# EasyEDA Pro project 仿生青蛙驱动控制板-STM32F1-4.0.eprj

# Schematic Schematic1
Create Date: 2024-03-05; Page Name: P1; Project Name: 仿生青蛙驱动控制板-STM32F1-2.0 - 副本; Schematic Name: Schematic1; Update Date: 2024-03-24; Company: 嘉立创EDA; Page Size: A4; Version: V1.0
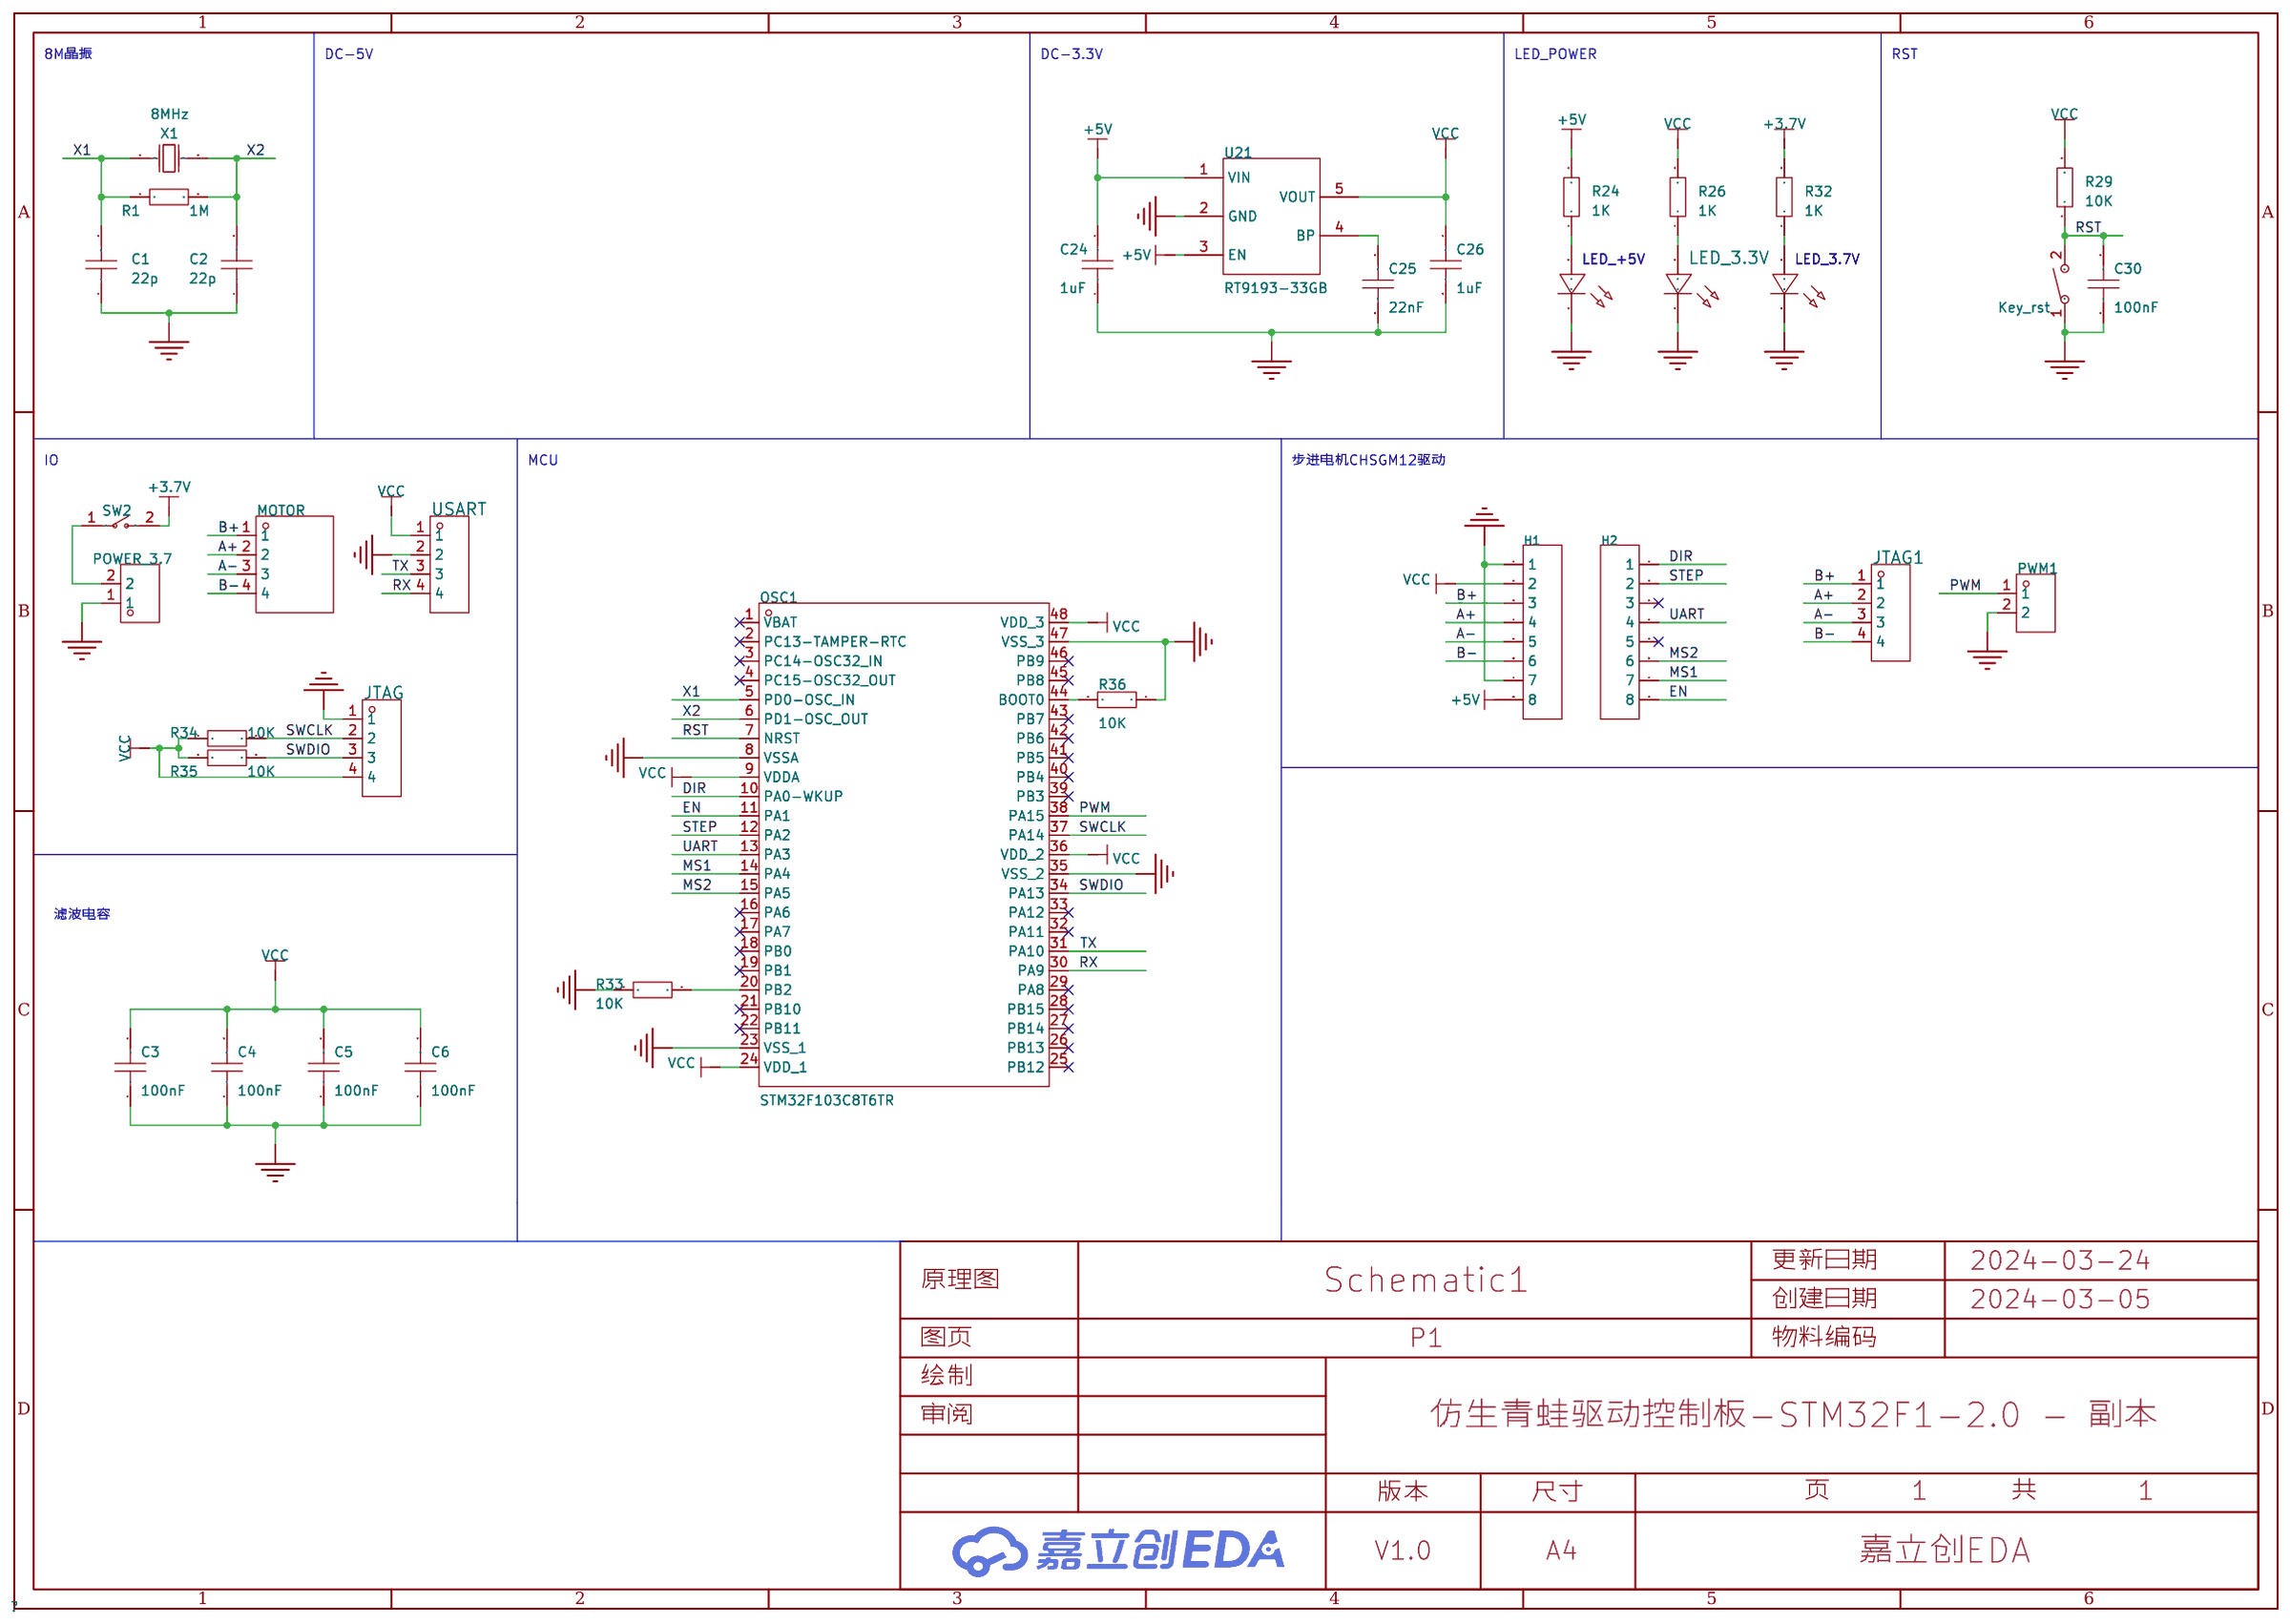
[diagram p0: schematic sheet]

## Parts
C1  22p  [c0603]
C2  22p  [c0603]
C3  100nF  [c0603]
C4  100nF  [c0603]
C5  100nF  [c0603]
C6  100nF  [c0603]
C24  1uF  [c0603]
C25  22nF  [c0603]
C26  1uF  [c0603]
C30  100nF  [c0603]
H1  -  [HDR-TH_8P-P2.54-V-F-1]
H2  -  [HDR-TH_8P-P2.54-V-F-1]
JTAG  -  [HDR-TH_4P-P2.54-V-F]
JTAG1  -  [HDR-TH_4P-P2.54-V-F]
Key_rst  TS-1092S-B3D2-G  [SW-SMD_L6.1-W3.6-LS7.9]
LED_3.3V  -  [LED_0603]
LED_3.7V  -  [LED_0603]
LED_+5V  -  [LED_0603]
MOTOR  DF13-4P-1.25DSA  [CONN-TH_DF13-4P-1.25DSA]
OSC1  STM32F103C8T6TR  [LQFP-48_L7.0-W7.0-P0.50-LS9.0-BL]
POWER_3.7  ZX-XH2.54-2PZZ  [CONN-TH_2P-P2.50_HX25003-2A]
PWM1  ZX-XH2.54-2PZZ  [CONN-TH_2P-P2.50_HX25003-2A]
R1  1M  [r0603]
R24  1K  [r0603]
R26  1K  [r0603]
R29  10K  [r0603]
R32  1K  [r0603]
R33  10K  [r0603]
R34  10K  [r0603]
R35  10K  [r0603]
R36  10K  [r0603]
SW2  KCD11-2P-R  [SW-TH_2P-L15.0-W10.5-P5.00_KCD11-2P-R]
U21  RT9193-33GB  [SOT-23-5_L3.0-W1.7-P0.95-LS2.8-BL]
USART  -  [HDR-TH_4P-P2.54-V-F]
X1  8MHz  [CRYSTAL-SMD_L5.0-W3.2]

## Library data of the parts
C1-C6 C24-C26 C30 = CAP_0402: Supplier Footprint: 0402
H1 H2 = HDR-F_2.54_1x8P: Supplier Part: C27438; Supplier Footprint: 插件
JTAG JTAG1 USART = HDR-F_2.54_1x4P: Supplier Part: C2718488; Supplier Footprint: 插件
Key_rst = TS-1092S-B3D2-G: 电路结构:单刀单掷;按钮形状:矩形按钮;作用力:250gf;安装方式:立贴;开关长度:6.1mm;开关宽度:3.6mm;开关高度:2.5mm;带支架:不带;机械寿命:-;; LCSC Part Name: 6.1*3.6*2.5mm 立贴 轻触开关; Supplier Part: C520860; Manufacturer: Yuandi(元迪); Supplier Footprint: SMD; JLCPCB Part Class: 扩展库; Datasheet: https://atta.szlcsc.com/upload/public/pdf/source/20200424/C520860_DA5AE47D9A9DC527FC720B5FF0895739.pdf; Supplier: LCSC; Circuit: 单刀单掷; Actuator Style: 矩形按钮; Operating Force: 250gf; Mounting Style: 立贴; Switch Length: 6.1mm; Switch Width: 3.6mm; Switch Height: 2.5mm; Strike Gundam: 不带; Actuator/Cap Color: 灰色; Pin Style: 鸥翼型
LED_3.3V = LED_0402-R: Supplier Footprint: 0402
LED_3.7V = LED_0402-B: Supplier Footprint: 0402
LED_+5V = LED_0603-G: Supplier Footprint: 0603
MOTOR = DF13-4P-1.25DSA: 插针结构:1x4P;间距:1.25mm;安装方式:-;参考系列:-;总PIN数:4P;排数:1;每排PIN数:4;行距:-;触头材质:黄铜;; LCSC Part Name: 间距:1.25mm 1x4P; Supplier Part: C202091; Manufacturer: HRS(广濑); Supplier Footprint: P=1.25mm; JLCPCB Part Class: Extended Part; Datasheet: https://atta.szlcsc.com/upload/public/pdf/source/20180509/C202091_DB48A71B72F23293CB2FD82E8A62B156.pdf; Supplier: LCSC; Pins Structure: 1x4P; Pitch: 1.25mm; Number of Pins: 4P; Number of Rows: 1; Number of PINs Per Row: 4; Contact Material: 黄铜
OSC1 = STM32F103C8T6TR: CPU内核:CM3;程序存储容量:64KB;RAM总容量:20KB;GPIO端口数量:37;工作电压范围:2V~3.6V;CPU最大主频:72MHz;程序存储器类型:-;; Supplier Part: C2969777; Manufacturer: ST(意法半导体); Supplier Footprint: LQFP-48(7x7); JLCPCB Part Class: 扩展库; Datasheet: https://atta.szlcsc.com/upload/public/pdf/source/20220628/95EE8CB51361BFD20205E6D0986143A8.pdf; Supplier: LCSC; CPU Core: CM3; Program Storage Size: 64KB; RAM Size: 20KB; GPIO Ports Number: 37; Operating Voltage Range: 2V~3.6V; CPU Maximum Speed: 72MHz; Operating Temperature Range: -40℃~+85℃; ADC (Bit): 12bit; Universal Serial Bus: 有; Peripheral/Function: 温度传感器; Watchdog: 有; Infrared Data Association: 有; Low-Voltage Detect: 有; Direct Memory Access: 有; Internal Oscillator: 有
POWER_3.7 PWM1 = ZX-XH2.54-2PZZ: 插针结构:1x2P;间距:2.54mm;安装方式:直插;参考系列:XH;总PIN数:2P;排数:1;每排PIN数:2;行距:-;额定电流:3A;触头材质:黄铜;触头镀层:锡;工作温度范围:-25℃~+85℃;; Supplier Part: C7429632; Manufacturer: Megastar(兆星); Supplier Footprint: 插件,P=2.54mm; JLCPCB Part Class: Extended Part; Datasheet: https://atta.szlcsc.com/upload/public/pdf/source/20230619/19BA6947230AA44A04D3EDD65E618FD0.pdf; Supplier: LCSC; Pins Structure: 1x2P; Pitch: 2.54mm; Mounting Style: 直插; Reference Series: XH; Number of Pins: 2P; Number of Rows: 1; Number of PINs Per Row: 2; Current Rating (Max): 3A; Contact Material: 黄铜; Contact Plating: 锡; Operating Temperature Range: -25℃~+85℃
R1 R26 R29 R32-R35 = Res_0402: Supplier Footprint: 0402
R24 = Res_0805: Supplier Footprint: 0805
R36 = Res_0603: Supplier Footprint: 0603
SW2 = KCD11-2P-R: 带灯:无;引脚样式:焊片;额定电流:3A;额定电压(AC):250V;额定电压(DC):-;电路结构:单刀单掷;机械寿命:1万次;; LCSC Part Name: 10.5*15mm 两脚两档跷板开关 红钮; Supplier Part: C5884414; Manufacturer: SHOU HAN(首韩); Supplier Footprint: 插件; JLCPCB Part Class: Extended Part; Datasheet: https://atta.szlcsc.com/upload/public/pdf/source/20230506/CD06DFDE35C8048D34175BFF4AF6A2C2.pdf; Supplier: LCSC; Switch Length: 15mm; Switch Width: 10.5mm; Switch Height: 17.2mm; Actuator Type: 凹面弯曲; With Lamp: 无; Pin Style: 焊片; Actuator Color: 红色; Contact Current: 3A; Voltage Rating (AC): 250V; Circuit: 单刀单掷; Mechanical Life: 1万次; Operating Temperature: 0℃~+125℃; Actuator Identifier: - O
U21 = RT9193-33GB: 输出类型:固定;最大输入电压:5.5V;输出电压:3.3V;最大输出电流:300mA;电源纹波抑制比(PSRR):70dB;输出极性:正极;; LCSC Part Name: 输入5.5V 输出3.3V 300mA; Supplier Part: C15651; Manufacturer: RICHTEK(立锜); Supplier Footprint: SOT-23-5; JLCPCB Part Class: 扩展库; Datasheet: https://atta.szlcsc.com/upload/public/pdf/source/20130730/1457706628575.pdf; Supplier: LCSC; Output Type: 固定; Maximum Input Voltage: 5.5V; Output Voltage: 3.3V; MAX Output Current: 300mA; Power Supply Rejection Ratio (PSRR): 70dB; Dropout Voltage: 300mV@(300mA); standby current: 130uA; Operating Temperature: -40℃~+125℃; Output Polarity: 正极; Number of Outputs: 1
X1 = X50328MSB2GI: 晶振类型:贴片晶振;频率:8MHz;常温频差:±10ppm;外接负载电容:20pF;频率稳定度(全温):±50ppm;; LCSC Part Name: 8MHz ±10ppm 20pF YSX530GA; Supplier Part: C115962; Manufacturer: YXC(扬兴晶振); Supplier Footprint: SMD5032; JLCPCB Part Class: Basic Part; Datasheet: https://atta.szlcsc.com/upload/public/pdf/source/20230220/0EBFFB9D6D8CE6A211407822BBB6C516.pdf; Supplier: LCSC; Crystal Type: 贴片晶振; Normal temperature Frequency Tolerance: ±10ppm; External load capacitor: 20pF; Frequency Stability(Full temperature range): ±50ppm; Operating Temperature: -40℃~+85℃

## Nets
+3.7V: R32.2 SW2.2
+5V: C24.2 H1.8 R24.2 U21.1(VIN) U21.3(EN)
GND: C1.1 C2.1 C3.1 C4.1 C5.1 C6.1 C24.1 C25.2 C26.2 C30.1 H1.1 H1.7 JTAG.1 Key_rst.1 LED_3.3V.1(C) LED_3.7V.1(C) LED_+5V.1(C) OSC1.8(VSSA) OSC1.23(VSS_1) OSC1.35(VSS_2) OSC1.47(VSS_3) POWER_3.7.1 PWM1.2 R33.1 R36.1 U21.2(GND) USART.2
VCC: C3.2 C4.2 C5.2 C6.2 C26.1 H1.2 JTAG.4 OSC1.9(VDDA) OSC1.24(VDD_1) OSC1.36(VDD_2) OSC1.48(VDD_3) R26.2 R29.2 R34.1 R35.1 U21.5(VOUT) USART.1
A+: H1.4 JTAG1.2 MOTOR.2
A-: H1.5 JTAG1.3 MOTOR.3
B+: H1.3 JTAG1.1 MOTOR.1
B-: H1.6 JTAG1.4 MOTOR.4
DIR: H2.1 OSC1.10(PA0-WKUP)
EN: H2.8 OSC1.11(PA1)
MS1: H2.7 OSC1.14(PA4)
MS2: H2.6 OSC1.15(PA5)
PWM: OSC1.38(PA15) PWM1.1
RST: C30.2 Key_rst.2 OSC1.7(NRST) R29.1
RX: OSC1.30(PA9) USART.4
STEP: H2.2 OSC1.12(PA2)
SWCLK: JTAG.2 OSC1.37(PA14) R34.2
SWDIO: JTAG.3 OSC1.34(PA13) R35.2
TX: OSC1.31(PA10) USART.3
UART: H2.4 OSC1.13(PA3)
X1: C1.2 OSC1.5(PD0-OSC_IN) R1.1 X1.1(OSC1)
X2: C2.2 OSC1.6(PD1-OSC_OUT) R1.2 X1.2(OSC2)
$1N3570: C25.1 U21.4(BP)
$1N6675: OSC1.20(PB2) R33.2
$1N16517: OSC1.44(BOOT0) R36.2
$1N19691: POWER_3.7.2 SW2.1
Net-(LED_3.3V-2): LED_3.3V.2(A) R26.1
Net-(LED_3.7V-2): LED_3.7V.2(A) R32.1
Net-(LED_+5V-2): LED_+5V.2(A) R24.1

Not connected (* = marked no-connect by the designer): H2 3* 5*; OSC1 1(VBAT)* 2(PC13-TAMPER-RTC)* 3(PC14-OSC32_IN)* 4(PC15-OSC32_OUT)* 16(PA6)* 17(PA7)* 18(PB0)* 19(PB1)* 21(PB10)* 22(PB11)* 25(PB12)* 26(PB13)* 27(PB14)* 28(PB15)* 29(PA8)* 32(PA11)* 33(PA12)* 39(PB3)* 40(PB4)* 41(PB5)* 42(PB6)* 43(PB7)* 45(PB8)* 46(PB9)*

## Notes on the sheet
- 8M晶振
- DC-5V
- DC-3.3V
- LED_POWER
- RST
- IO
- MCU
- 步进电机CHSGM12驱动
- 滤波电容

# Board PCB1
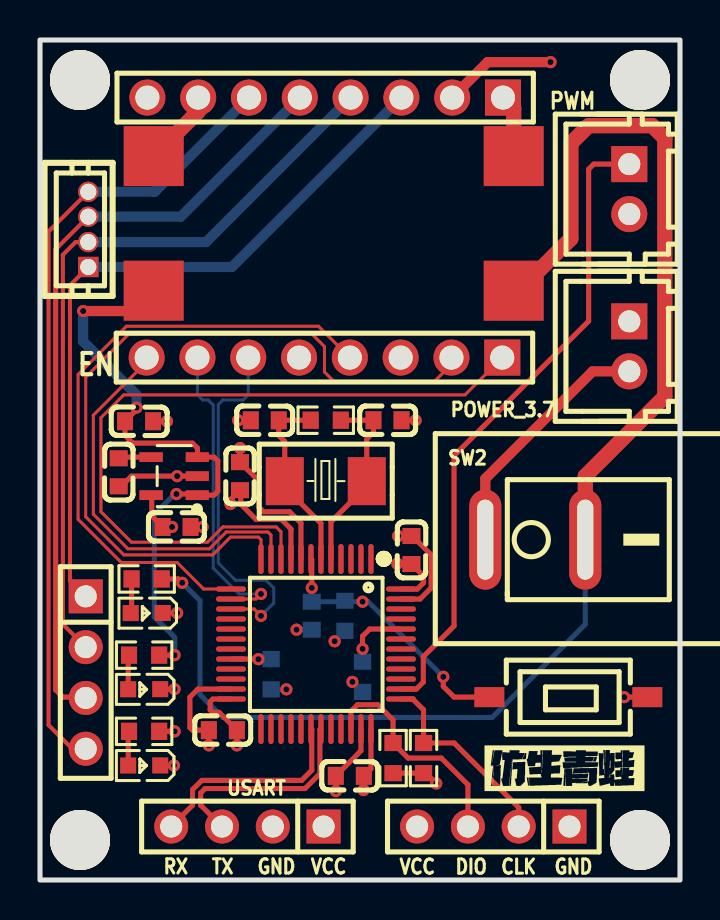
[diagram p1: board, top side]
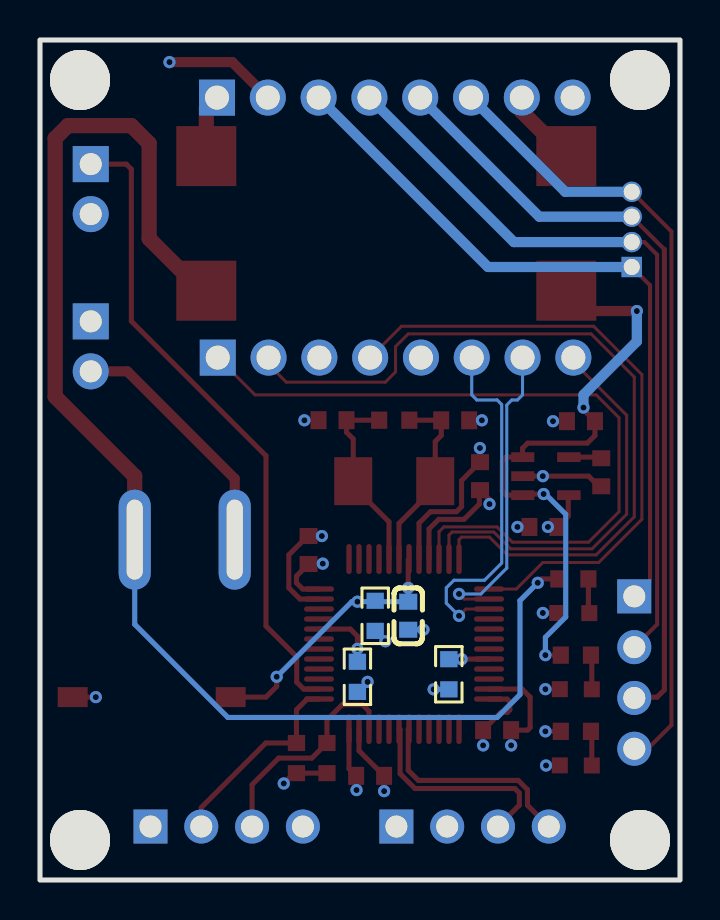
[diagram p2: board, bottom side, seen from below]

Outline 32 x 42 mm; copper layers: Top Layer, POWER, GND, Bottom Layer. Coordinates in mm from the lower left corner of the outline.
Outline path: rectangle 0,42 32,0
Stack: Top Layer 0.035mm 外层铜厚1oz / Dielectric1 0.2104mm 7628 RC49% 8.6mil / POWER 0.0152mm 内层铜厚 / Dielectric2 1.065mm 1.1mm H/HOZ 含铜 / GND 0.0152mm 内层铜厚 / Dielectric3 0.2104mm 7628 RC49% 8.6mil / Bottom Layer 0.035mm 外层铜厚1oz

## Design rules (mm)
net RX: USART
net TX: USART
template: JLCPCB Capability(Two Layers Board)
spacing copperThickness1oz (default): track to track 0.102, other pairs 0.152 to 0.3
spacing copperThickness2oz: track to track 0.203, other pairs 0.152 to 0.3
track width copperThickness1oz (default): min 0.127, default 0.254, max 2.54
track width copperThickness2oz: min 0.203, default 0.254, max 2.54
differential pair differentialPair (default): width min 0.127, default 0.254, max 2.54; gap min 0.152, default 0.152
via viaSize (default): diameter min 0.5, default 0.61, max 10; hole min 0.3, default 0.305, max 6.3

## Placement (name value [footprint] x y rotation side)
3.3V  -  [LED_0603]  5.16 5.72 180 top
3.7V  -  [LED_0603]  5.29 13.34 180 top
+5V  -  [LED_0603]  5.16 9.53 180 top
C1  22p  [c0603]  17.37 22.99 180 top
C2  22p  [c0603]  11.24 22.98 0 top
C3  100nF  [c0603]  9.14 7.49 0 top
C4  100nF  [c0603]  15.49 5.21 0 top
C5  100nF  [c0603]  18.57 16.5 270 top
C6  100nF  [c0603]  10 20.19 270 top
C24  1uF  [c0603]  4.95 22.94 180 top
C25  22nF  [c0603]  3.94 20.39 270 top
C26  1uF  [c0603]  6.83 17.65 0 top
C30  100nF  [c0603]  13.59 13.22 90 bottom
H1  -  [HDR-TH_8P-P2.54-V-F-1]  14.26 39.12 180 top
H2  -  [HDR-TH_8P-P2.54-V-F-1]  14.22 26.12 180 top
JTAG  -  [HDR-TH_4P-P2.54-V-F]  22.67 2.67 180 top
JTAG1  -  [HDR-TH_4P-P2.54-V-F]  2.29 10.37 270 top
Key_rst  TS-1092S-B3D2-G  [SW-SMD_L6.1-W3.6-LS7.9]  26.42 9.14 180 top
MOTOR  DF13-4P-1.25DSA  [CONN-TH_DF13-4P-1.25DSA]  2.41 32.53 270 top
NOREF  -  [Pad_e44]  5.69 29.46 0 top
NOREF#2  -  [Pad_e46]  23.69 29.46 0 top
NOREF#3  -  [Pad_e37]  5.69 36.19 0 top
NOREF#4  -  [Pad_e2040]  30 40 0 top
NOREF#5  -  [Pad_e2041]  2 2 0 top
NOREF#6  -  [Pad_e2042]  30 2 0 top
NOREF#7  -  [Pad_e2038]  2 40 0 top
NOREF#8  -  [Pad_e45]  23.69 36.19 0 top
OSC1  STM32F103C8T6TR  [LQFP-48_L7.0-W7.0-P0.50-LS9.0-BL]  13.8 11.8 180 top
POWER_3.7  ZX-XH2.54-2PZZ  [CONN-TH_2P-P2.50_HX25003-2A]  29.46 26.68 270 top
PWM1  ZX-XH2.54-2PZZ  [CONN-TH_2P-P2.50_HX25003-2A]  29.46 34.54 270 top
R1  1M  [r0603]  14.29 22.99 180 top
R24  1K  [r0603]  5.21 11.24 0 top
R26  1K  [r0603]  5.21 7.43 0 top
R29  10K  [r0603]  15.24 13.21 270 bottom
R32  1K  [r0603]  5.33 15.05 0 top
R33  10K  [r0603]  11.56 10.29 90 bottom
R34  10K  [r0603]  19.18 6.1 90 top
R35  10K  [r0603]  17.65 6.1 90 top
R36  10K  [r0603]  16.13 10.16 90 bottom
SW2  KCD11-2P-R  [SW-TH_2P-L15.0-W10.5-P5.00_KCD11-2P-R]  24.76 17.02 0 top
U21  RT9193-33GB  [SOT-23-5_L3.0-W1.7-P0.95-LS2.8-BL]  6.71 20.19 90 top
USART  -  [HDR-TH_4P-P2.54-V-F]  10.37 2.67 180 top
X1  8MHz  [CRYSTAL-SMD_L5.0-W3.2]  14.29 19.94 180 top

## Footprints (pads in the part's own frame, mm; a bottom-side part is the same pattern mirrored in y, then rotated)
c0603
  rect 0.8x0.9 smd: 1(-0.7,0) 2(0.7,0)
CONN-TH_2P-P2.50_HX25003-2A
  rect 1.8x1.8 hole 1.1: 1(-1.25,0)
  round 1.8 hole 1.1: 2(1.25,0)
CONN-TH_DF13-4P-1.25DSA
  rect 1.016x1.016 hole 0.8: 1(1.879,0)
  round 1.016 hole 0.8: 2(0.635,0) 3(-0.635,0) 4(-1.879,0)
CRYSTAL-SMD_L5.0-W3.2
  rect 1.9x2.4 smd: 1(-2.05,0) 2(2.05,0)
HDR-TH_4P-P2.54-V-F
  rect 1.7x1.7 hole 1.1: 1(-3.81,0)
  round 1.7 hole 1.1: 2(-1.27,0) 3(1.27,0) 4(3.81,0)
HDR-TH_8P-P2.54-V-F-1
  rect 1.8x1.8 hole 1.2: 1(-8.89,0)
  round 1.8 hole 1.2: 2(-6.35,0) 3(-3.81,0) 4(-1.27,0) 5(1.27,0) 6(3.81,0) 7(6.35,0) 8(8.89,0)
LED_0603
  rect 0.8x0.8 smd: 1(-0.851,-0.01) 2(0.75,-0.005)
LQFP-48_L7.0-W7.0-P0.50-LS9.0-BL
  oval 0.27x1.5 smd: 1(-2.75,-4.25) 2(-2.25,-4.25) 3(-1.75,-4.25) 4(-1.25,-4.25) 5(-0.75,-4.25) 6(-0.25,-4.25) 7(0.25,-4.25) 8(0.75,-4.25) 9(1.25,-4.25) 10(1.75,-4.25) 11(2.25,-4.25) 12(2.75,-4.25) 25(2.75,4.25) 26(2.25,4.25) 27(1.75,4.25) 28(1.25,4.25) 29(0.75,4.25) 30(0.25,4.25) 31(-0.25,4.25) 32(-0.75,4.25) 33(-1.25,4.25) 34(-1.75,4.25) 35(-2.25,4.25) 36(-2.75,4.25)
  oval 1.5x0.27 smd: 13(4.25,-2.75) 14(4.25,-2.25) 15(4.25,-1.75) 16(4.25,-1.25) 17(4.25,-0.75) 18(4.25,-0.25) 19(4.25,0.25) 20(4.25,0.75) 21(4.25,1.25) 22(4.25,1.75) 23(4.25,2.25) 24(4.25,2.75) 37(-4.25,2.75) 38(-4.25,2.25) 39(-4.25,1.75) 40(-4.25,1.25) 41(-4.25,0.75) 42(-4.25,0.25) 43(-4.25,-0.25) 44(-4.25,-0.75) 45(-4.25,-1.25) 46(-4.25,-1.75) 47(-4.25,-2.25) 48(-4.25,-2.75)
Pad_e37
  rect 3x3 smd: 1(0,0)
Pad_e44
  rect 3x3 smd: 1(0,0)
Pad_e45
  rect 3x3 smd: 1(0,0)
Pad_e46
  rect 3x3 smd: 1(0,0)
Pad_e2038
  round 3 hole 3: 1(0,0)
Pad_e2040
  round 3 hole 3: 1(0,0)
Pad_e2041
  round 3 hole 3: 1(0,0)
Pad_e2042
  round 3 hole 3: 1(0,0)
r0603
  rect 0.806x0.864 smd: 1(-0.753,0) 2(0.753,0)
SOT-23-5_L3.0-W1.7-P0.95-LS2.8-BL
  rect 0.49x1.157 smd: 1(-0.95,-1.153) 2(0,-1.153) 3(0.95,-1.153)
  rect 0.49x1.175 smd: 4(0.95,1.153) 5(-0.95,1.153)
SW-SMD_L6.1-W3.6-LS7.9
  rect 1.5x1 smd: 1(-3.95,0) 2(3.95,0)
SW-TH_2P-L15.0-W10.5-P5.00_KCD11-2P-R
  oval 1.6x5 hole 0.8x4: 1(-2.5,0) 2(2.5,0)

## Nets
+3.7V: NOREF#2.1 R32.2 SW2.2
+5V: C24.2 H1.8 NOREF.1 R24.2 U21.1 U21.3
GND: 3.3V.1 3.7V.1 +5V.1 C1.1 C2.1 C3.1 C4.1 C5.1 C6.1 C24.1 C25.2 C26.2 C30.1 H1.1 H1.7 JTAG.1 Key_rst.1 NOREF#3.1 NOREF#4.1 NOREF#5.1 NOREF#6.1 NOREF#7.1 NOREF#8.1 OSC1.8 OSC1.23 OSC1.35 OSC1.47 POWER_3.7.1 PWM1.2 R33.1 R36.1 U21.2 USART.2
VCC: C3.2 C4.2 C5.2 C6.2 C26.1 H1.2 JTAG.4 OSC1.9 OSC1.24 OSC1.36 OSC1.48 R26.2 R29.2 R34.1 R35.1 U21.5 USART.1
A+: H1.4 JTAG1.2 MOTOR.2
A-: H1.5 JTAG1.3 MOTOR.3
B+: H1.3 JTAG1.1 MOTOR.1
B-: H1.6 JTAG1.4 MOTOR.4
DIR: H2.1 OSC1.10
EN: H2.8 OSC1.11
MS1: H2.7 OSC1.14
MS2: H2.6 OSC1.15
PWM: OSC1.38 PWM1.1
RST: C30.2 Key_rst.2 OSC1.7 R29.1
RX: OSC1.30 USART.4
STEP: H2.2 OSC1.12
SWCLK: JTAG.2 OSC1.37 R34.2
SWDIO: JTAG.3 OSC1.34 R35.2
TX: OSC1.31 USART.3
UART: H2.4 OSC1.13
X1: C1.2 OSC1.5 R1.1 X1.1
X2: C2.2 OSC1.6 R1.2 X1.2
$1N1985: +5V.2 R24.1
$1N3570: C25.1 U21.4
$1N3715: 3.3V.2 R26.1
$1N6481: 3.7V.2 R32.1
$1N6675: OSC1.20 R33.2
$1N16517: OSC1.44 R36.2
$1N19691: POWER_3.7.2 SW2.1

Pads without a net: H2 3 5; OSC1 1 2 3 4 16 17 18 19 21 22 25 26 27 28 29 32 33 39 40 41 42 43 45 46

## Via types
v1: diameter 0.61, hole 0.305, Top Layer to Bottom Layer, 37 vias

## Routing (per net, layer and track width the routed paths; a pad name or vN(x,y) marks a point on that pad's centre or on a via; arc(x,y) is an arc through that point)
+3.7V: length 68.7
  Top Layer w0.254: R32.2 6.92,15.05 v1(7.11,14.86)
  Top Layer w0.762: NOREF#2.1 23.94,29.46 26.54,32.07 26.54,36.83 27.43,37.72 30.61,37.72 31.24,37.08 31.24,24.17 27.26,20.19 SW2.2
  Bottom Layer w0.254: SW2.2 27.26,12.79 22.61,8.13 9.14,8.13 8,9.27 8,13.97 v1(7.11,14.86)
+5V: length 30.4
  Top Layer w0.254: v1(4.83,23.62) 4.83,23.51 C24.2 4.25,22.22 4.63,21.84 7.62,21.84 7.87,21.59 7.87,21.15 U21.3 8.7,21.14 8.89,20.95 8.89,19.43 8.7,19.24 U21.1 7.81,19.3 v1(6.82,19.3) ; R24.2 v1(6.73,11.24)
  Top Layer w0.508: NOREF.1 4.67,28.45 v1(2.16,28.45)
  Bottom Layer w0.254: v1(6.82,19.3) 6.73,19.3 5.72,18.29 5.72,13.15 6.73,12.13 v1(6.73,11.24)
  Bottom Layer w0.508: v1(2.16,28.45) 2.16,26.92 4.83,24.26 v1(4.83,23.62)
GND: length 41.1
  Top Layer w0.254: 13.05,16.05 13.05,17.84 12.48,18.42 11.18,18.42 10.92,18.67 10.92,19.97 C6.1 10,21.46 ; 3.3V.1 6.6,5.73 ; 18.05,14.05 19,14.05 19.56,14.61 19.56,16.26 18.62,17.2 C5.1 v1(17.91,17.2) ; C1.1 18.67,22.99 ; C25.2 4.07,19.69 4.57,20.19 v1(6.86,20.19) U21.2 ; C24.1 v1(6.35,22.94) ; OSC1.23 7.9,9.55 7.49,9.14 7.49,7.62 7.62,7.49 C3.1 v1(8.44,6.73) ; Key_rst.1 v1(29.21,9.14) ; 3.7V.1 v1(6.86,13.35) ; C2.1 v1(9.91,22.98) ; v1(14.79,4.44) C4.1 16.05,6.46 16.05,7.55 ; +5V.1 v1(6.73,9.54) ; C26.2 v1(8.13,17.65)
  Top Layer w0.762: NOREF#8.1 23.69,38.58 H1.1 ; NOREF#3.1 7.91,38.42 H1.7
  Bottom Layer w0.254: C30.1 v1(12.83,12.52) ; v1(15.62,9.91) 15.63,9.91 R36.1 ; R33.1 v1(12.32,9.53)
  vias: v1(6.7,5.72) v1(10,21.6) v1(18.78,22.98)
VCC: length 28.2
  Top Layer w0.254: v1(9.84,6.73) C3.2 8.96,8.38 8.64,8.38 8.51,8.51 8.51,8.91 8.65,9.05 OSC1.24 ; v1(19.81,4.83) 19.3,5.34 R34.1 R35.1 ; R26.2 v1(6.73,7.43) ; OSC1.9 12.55,17.55 12.06,18.03 10.79,18.03 10.03,18.8 10.03,19.46 C6.2 9.53,19.02 v1(9.53,18.8) ; OSC1.36 16.55,5.56 C4.2 16.19,4.57 ; v1(6.6,17.65) C26.1 5.59,18.19 5.59,19.21 U21.5 ; 18.05,14.55 18.87,14.55 19.18,14.86 19.18,15.19 C5.2 17.91,15.8
  Top Layer w0.508: H1.2 22.38,40.89 v1(25.53,40.89)
  Bottom Layer w0.254: v1(14.73,11.94) 15.24,12.45 R29.2
  vias: v1(16.17,4.5) v1(17.86,15.82)
A+: length 37.7
  Top Layer w0.203: JTAG1.2 1.14,12.79 1.14,31.26 1.78,31.9 MOTOR.2
  Bottom Layer w0.508: MOTOR.2 8.3,31.9 H1.4
A-: length 39
  Top Layer w0.203: MOTOR.3 0.78,31.54
  Top Layer w0.254: 0.78,31.54 0.78,9.5 1.14,9.14 2.24,9.14 JTAG1.3
  Bottom Layer w0.508: H1.5 7.03,33.17 MOTOR.3
B+: length 36.3
  Top Layer w0.203: MOTOR.1 1.5,29.74 1.5,14.97 JTAG1.1
  Bottom Layer w0.508: MOTOR.1 9.6,30.65 H1.3
B-: length 39.8
  Top Layer w0.203: JTAG1.4 1.61,6.56 0.43,7.75 0.43,32.42 MOTOR.4
  Bottom Layer w0.508: H1.6 5.74,34.41 MOTOR.4
DIR: length 37.4
  Top Layer w0.152: 12.05,16.05 12.05,17.42 11.81,17.65 9.14,17.65 8.38,16.89 4.57,16.89 3.05,18.42 3.05,23.11 4.19,24.26 21.25,24.26 H2.1
EN: length 20.1
  Top Layer w0.152: H2.8 5.33,25.91 2.67,23.24 2.67,18.29 4.4,16.56 8.47,16.56 9.31,17.4 11.4,17.4 11.55,17.25 OSC1.11
MS1: length 15.5
  Top Layer w0.152: v1(11.05,14.3) 10.79,14.05 OSC1.14
  Bottom Layer w0.152: 7.87,26.12 7.87,24.26 8.13,24 8.41,24 8.66,23.75 8.66,15.6 9.96,14.3 v1(11.05,14.3)
MS2: length 18.1
  Top Layer w0.152: OSC1.15 10.71,13.55 v1(11.05,13.21)
  Bottom Layer w0.152: v1(11.05,13.21) 11.68,13.84 11.68,14.61 11.3,14.99 9.78,14.99 8.92,15.85 8.92,23.78 9.14,24 10.16,24 10.41,24.26 H2.6
PWM: length 32.5
  Top Layer w0.254: PWM1.1 27.69,35.79 27.43,35.54 27.43,27.94 20.7,21.21 20.7,12.7 19.16,11.16 19.16,9.89 18.82,9.55 18.05,9.55
RST: length 13.3
  Top Layer w0.254: Key_rst.2 20.7,9.14 20.16,9.68 v1(20.16,10.16) ; v1(13.59,14.61) 13.59,16.01 OSC1.7
  Bottom Layer w0.254: 15.19,13.92 v1(16.13,13.92) 16.41,13.92 v1(20.16,10.16) ; 15.19,13.92 R29.1 ; 15.19,13.92 C30.2 13.59,14.61
RX: length 10.7
  Top Layer w0.254: USART.4 7.63,3.74 7.63,4.52 8.09,4.98 13.08,4.98 13.59,5.49 13.59,7.53 13.57,7.55 OSC1.30
STEP: length 39.6
  Top Layer w0.152: 11.05,16.05 11.05,17.02 10.92,17.14 9.53,17.14 8.64,16.26 4.19,16.26 2.29,18.16 2.29,25.15 4.44,27.31 13.59,27.31 14.22,26.67 14.22,25.4 14.73,24.89 19.69,24.89 20.57,25.78 H2.2
SWCLK: length 10.1
  Top Layer w0.254: 18.05,9.05 18.64,9.05 19.18,8.51 R34.2 20.71,6.85 23.94,3.62 JTAG.2
SWDIO: length 11.3
  Top Layer w0.254: OSC1.34 15.55,8.44 15.88,8.76 16.89,8.76 17.65,8 R35.2 18.41,6.1 20.07,6.1 21.4,4.77 JTAG.3
TX: length 10.8
  Top Layer w0.254: USART.3 8.03,3.74 8.03,4.35 8.25,4.57 13.25,4.57 14,5.32 14,7.53 14.02,7.55 14.05,7.55
UART: length 31.6
  Top Layer w0.152: H2.4 13.93,27.69 4.32,27.69 1.91,25.27 1.91,18.03 4.06,15.88 6.86,15.88 8.19,14.55 OSC1.13
X1: length 9.5
  Top Layer w0.254: 15.04,22.99 C1.2 16.67,22.39 16.34,22.05 X1.1 16.34,19.7 14.55,17.91 OSC1.5
X2: length 9.4
  Top Layer w0.254: R1.2 11.95,22.99 C2.2 11.94,22.98 11.94,22.22 12.24,21.92 X1.2 12.24,19.64 14.05,17.83 14.05,16.05
$1N1985: length 1.7
  Top Layer w0.254: +5V.2 4.41,11.2 R24.1
$1N3570: length 1.6
  Top Layer w0.254: U21.4 3.99,21.14 C25.1
$1N3715: length 1.7
  Top Layer w0.254: R26.1 4.41,7.39 3.3V.2
$1N6481: length 1.7
  Top Layer w0.254: 3.7V.2 4.58,13.39 R32.1
$1N6675: length 2
  Top Layer w0.254: OSC1.20 10.91,11.05 v1(10.92,11.04)
  Bottom Layer w0.254: R33.2 v1(10.92,11.04)
$1N16517: length 3.3
  Top Layer w0.254: v1(16.13,11.56) 16.13,12.19 16.49,12.55 18.05,12.55
  Bottom Layer w0.254: R36.2 v1(16.13,11.56)
$1N19691: length 12.5
  Top Layer w0.508: SW2.1 22.26,20.07 27.63,25.43 POWER_3.7.2

## Copper pours and planes (outline as drawn; the poured copper is in the pictures)
+5V on POWER: 0.26,41.74 24.51,41.74 24.51,18.58 0.26,18.58
GND on GND: 0.26,41.74 31.74,41.74 31.74,0.26 0.26,0.26
VCC on POWER: 0.26,41.74 31.74,41.74 31.74,0.26 0.26,0.26

Small or netless copper shapes (teardrops, artwork), in the pictures only: 12 on POWER, 32 on GND

## Text on the board
Top Silkscreen Layer: RX | TX | GND | VCC | DIO | CLK | PWM | EN
